# EAGLE schematic LI (EAGLE 7.4.0)
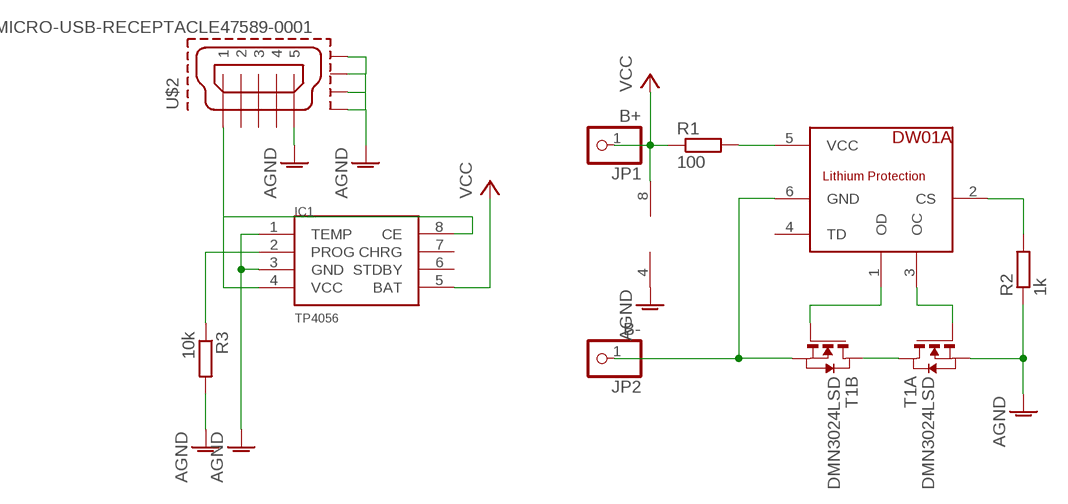
[diagram p0: schematic, sheet 1]

## Parts
IC1  TP4056  [SOP-8]
IC2  TL082D  [SO08]
JP1  B+  PINHD-1X1  [1X01]
JP2  B-  PINHD-1X1  [1X01]
R1  100  R-EU_R0805  [R0805]
R2  1k  R-EU_R0805  [R0805]
R3  10k  R-EU_R0805  [R0805]
T1  DMN3024LSD  [TSSOP-8]
U$1  DW01A  [SOT23-6]
U$2  MICRO-USB-RECEPTACLE47589-0001  [47589-0001]

## Nets
AGND: IC1.1(TEMP) IC1.3(GND) IC2.4(P:V-) R2.1 R3.2 T1.2(A:S) T1.3(A:S) U$2.5 U$2.CASING1(GND1) U$2.CASING2(GND2) U$2.CASING3(GND3) U$2.CASING4(GND4)
N$1: T1.4(A:G) U$1.3(OC)
N$2: T1.5(B:G) U$1.1(OD)
N$3: T1.1(A:D) T1.8(B:D)
N$4: R2.2 U$1.2(CS)
N$5: JP2.1 T1.6(B:S) T1.7(B:S) U$1.6(GND)
N$6: R1.2 U$1.5(VCC)
N$7: IC1.2(PROG) R3.1
N$9: IC1.4(VCC) IC1.8(CE) U$2.1
VCC: IC1.5(BAT) IC2.8(P:V+) JP1.1 R1.1
Unconnected: IC1.6(STDBY) IC1.7(CHRG) IC2.1(A:OUT) IC2.2(A:-IN) IC2.3(A:+IN) IC2.5(B:+IN) IC2.6(B:-IN) IC2.7(B:OUT) U$1.4(TD) U$2.2 U$2.3 U$2.4

## Library data of the parts
IC1 = TP4056:TP4056
IC2 = linear:TL082: OP AMP Data sheet <http://www.ti.com/lit/ds/symlink/tl084a . pdf>; DATA_SHEET: <a href="http://www.ti.com/lit/ds/symlink/tl084a.pdf"> Data sheet </a>
JP1 JP2 = pinhead:PINHD-1X1: PIN HEADER
R1-R3 = rcl:R-EU_: RESISTOR, European symbol
T1 = FS8205A:DMN3024LSD: DUAL N-CHANNEL ENHANCEMENT MODE MOSFET data sheet <http://goo.gl/dRgboR> Dave.Calaway Eagle Library <https://goo.gl/Muy1Tr>
U$1 = DW01a:DW01A
U$2 = con-molex-usb:MICRO-USB-RECEPTACLE: MICRO USB RECEPTACLES Micro-USB Receptacles, SMT, Lead-Free from MOLEX <http://www.molex.com/>. (C) 2014 Tomasz Boleslaw CEDRO, cederom@tlen.pl, http://www.tomek.cedro.info. Version 0.1 (2014-01-17): Initial release. Version 0.2 (2014-02-06): Updated 47589-0001 footprint pins/pads/milling. Following devices are included: 1. 47589-0001 Micro-USB AB Receptacle, Bottom Mount, SMT, Lead-Free <http://www.molex.com/molex/products/datasheet.jsp?part=active/0475890001_IO_CONNECTORS.xml> (Technical Drawing <http://www.molex.com/pdm_docs/sd/475890001_sd.pdf>).